# Altium project USRP2_Clone.PrjPcb (part 2 of 4)

## Sheet Ethernet.SchDoc: {Наименование}
size 420 x 297 mm; DocumentNumber: ПЛАС.ХХХХХХ.ХХХ ХХ; SheetNumber: 4; SheetTotal: 11; PageSetup: Record=PageOptions|CenterHorizontal=False|CenterVertical=False|PrintScale=0.95|XCorrection=0.00|YCorrection=0.00|PrintKind=1|BorderSize=5000000|LeftOffset=0|BottomOffset=0|Orientation=1|PaperLength=1000|PaperWidth=1000|Scale=100|PaperSource=15|PrintQuality=600|MediaType=1|DitherType=10|PaperKind=A4|PrintScaleMode=1; Rule: PcbType=ProtelPcb
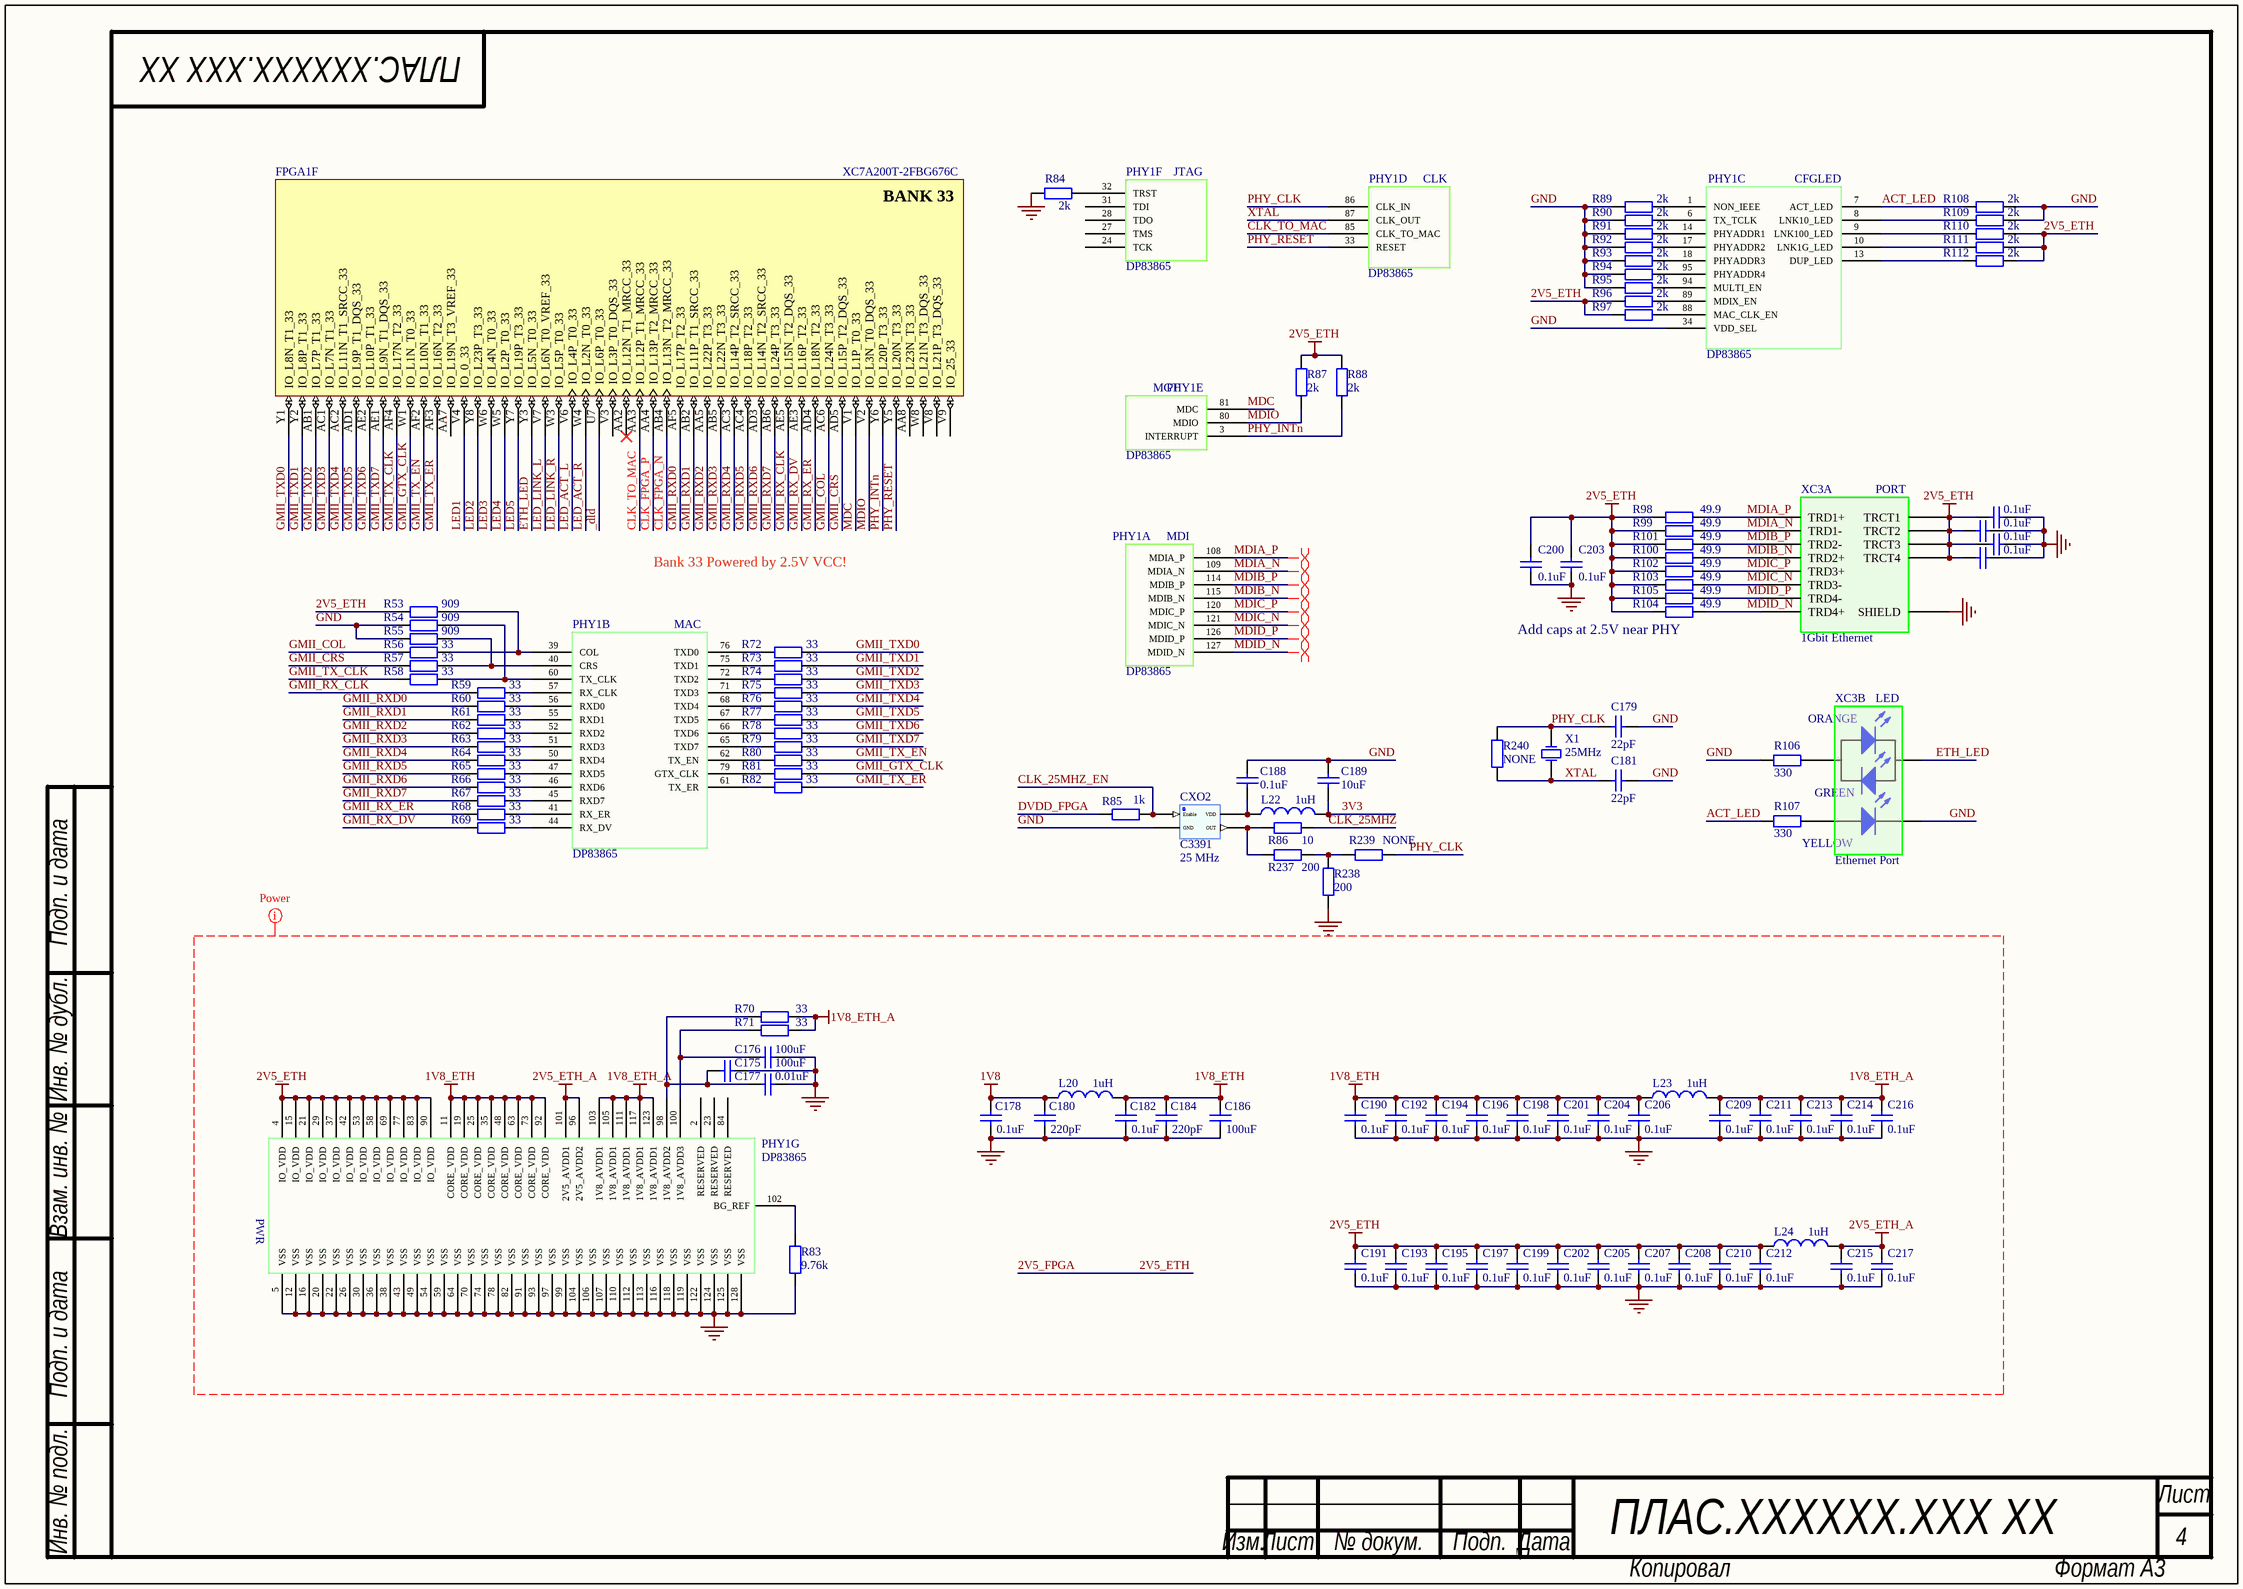
[diagram p3: Ethernet.SchDoc]

### Parts
C175  value 100uF  [C1210]  (hidden comment: Cap)
C176  value 100uF  [C1210]  (hidden comment: Cap)
C177  value 0.01uF  [C0603]  (hidden comment: Cap)
C178  value 0.1uF  [C0603]  (hidden comment: Cap)
C179  value 22pF  [С0402]  (hidden comment: Cap)
C180  value 220pF  [C0603]  (hidden comment: Cap)
C181  value 22pF  [С0402]  (hidden comment: Cap)
C182  value 0.1uF  [C0603]  (hidden comment: Cap)
C184  value 220pF  [C0603]  (hidden comment: Cap)
C186  value 100uF  [C1210]  (hidden comment: Cap)
C188  value 0.1uF  [C0603]  (hidden comment: Cap)
C189  value 10uF  [C0603]  (hidden comment: Cap)
C190  value 0.1uF  [C0603]  (hidden comment: Cap)
C191  value 0.1uF  [C0603]  (hidden comment: Cap)
C192  value 0.1uF  [C0603]  (hidden comment: Cap)
C193  value 0.1uF  [C0603]  (hidden comment: Cap)
C194  value 0.1uF  [C0603]  (hidden comment: Cap)
C195  value 0.1uF  [C0603]  (hidden comment: Cap)
C196  value 0.1uF  [C0603]  (hidden comment: Cap)
C197  value 0.1uF  [C0603]  (hidden comment: Cap)
C198  value 0.1uF  [C0603]  (hidden comment: Cap)
C199  value 0.1uF  [C0603]  (hidden comment: Cap)
C200  value 0.1uF  [С0402]  (hidden comment: Cap)
C201  value 0.1uF  [C0603]  (hidden comment: Cap)
C202  value 0.1uF  [C0603]  (hidden comment: Cap)
C203  value 0.1uF  [С0402]  (hidden comment: Cap)
C204  value 0.1uF  [C0603]  (hidden comment: Cap)
C205  value 0.1uF  [C0603]  (hidden comment: Cap)
C206  value 0.1uF  [C0603]  (hidden comment: Cap)
C207  value 0.1uF  [C0603]  (hidden comment: Cap)
C208  value 0.1uF  [C0603]  (hidden comment: Cap)
C209  value 0.1uF  [C0603]  (hidden comment: Cap)
C210  value 0.1uF  [C0603]  (hidden comment: Cap)
C211  value 0.1uF  [C0603]  (hidden comment: Cap)
C212  value 0.1uF  [C0603]  (hidden comment: Cap)
C213  value 0.1uF  [C0603]  (hidden comment: Cap)
C214  value 0.1uF  [C0603]  (hidden comment: Cap)
C215  value 0.1uF  [C0603]  (hidden comment: Cap)
C216  value 0.1uF  [C0603]  (hidden comment: Cap)
C217  value 0.1uF  [C0603]  (hidden comment: Cap)
C218  value 0.1uF  [С0402]  (hidden comment: Cap)
C219  value 0.1uF  [С0402]  (hidden comment: Cap)
C220  value 0.1uF  [С0402]  (hidden comment: Cap)
C221  value 0.1uF  [С0402]  (hidden comment: Cap)
CXO2  C3391  Frequency: 25 MHz  [CTS_CB3]
FPGA1  XC7A200T-2FBG676C  [FGG676]  (part F of 14)
L20  value 1uH  [L1210_Murata LQH]  (hidden comment: Inductor_LF)
L22  value 1uH  [L1206_Murata]  (hidden comment: Inductor_LF)
L23  value 1uH  [L1210_Murata LQH]  (hidden comment: Inductor_LF)
L24  value 1uH  [L1210_Murata LQH]  (hidden comment: Inductor_LF)
PHY1  DP83865  [LQFP-128]  (parts A,B,C,D,E,F,G of 7)
R53  value 909  [R0402]  (hidden comment: Res)
R54  value 909  [R0402]  (hidden comment: Res)
R55  value 909  [R0402]  (hidden comment: Res)
R56  value 33  [R0402]  (hidden comment: Res)
R57  value 33  [R0402]  (hidden comment: Res)
R58  value 33  [R0402]  (hidden comment: Res)
R59  value 33  [R0402]  (hidden comment: Res)
R60  value 33  [R0402]  (hidden comment: Res)
R61  value 33  [R0402]  (hidden comment: Res)
R62  value 33  [R0402]  (hidden comment: Res)
R63  value 33  [R0402]  (hidden comment: Res)
R64  value 33  [R0402]  (hidden comment: Res)
R65  value 33  [R0402]  (hidden comment: Res)
R66  value 33  [R0402]  (hidden comment: Res)
R67  value 33  [R0402]  (hidden comment: Res)
R68  value 33  [R0402]  (hidden comment: Res)
R69  value 33  [R0402]  (hidden comment: Res)
R70  value 33  [R0402]  (hidden comment: Res)
R71  value 33  [R0402]  (hidden comment: Res)
R72  value 33  [R0402]  (hidden comment: Res)
R73  value 33  [R0402]  (hidden comment: Res)
R74  value 33  [R0402]  (hidden comment: Res)
R75  value 33  [R0402]  (hidden comment: Res)
R76  value 33  [R0402]  (hidden comment: Res)
R77  value 33  [R0402]  (hidden comment: Res)
R78  value 33  [R0402]  (hidden comment: Res)
R79  value 33  [R0402]  (hidden comment: Res)
R80  value 33  [R0402]  (hidden comment: Res)
R81  value 33  [R0402]  (hidden comment: Res)
R82  value 33  [R0402]  (hidden comment: Res)
R83  value 9.76k  [R0402]  (hidden comment: Res)
R84  value 2k  [R0402]  (hidden comment: Res)
R85  value 1k  [R0402]  (hidden comment: Res)
R86  value 10  [R0402]  (hidden comment: Res)
R87  value 2k  [R0402]  (hidden comment: Res)
R88  value 2k  [R0402]  (hidden comment: Res)
R89  value 2k  [R0402]  (hidden comment: Res)
R90  value 2k  [R0402]  (hidden comment: Res)
R91  value 2k  [R0402]  (hidden comment: Res)
R92  value 2k  [R0402]  (hidden comment: Res)
R93  value 2k  [R0402]  (hidden comment: Res)
R94  value 2k  [R0402]  (hidden comment: Res)
R95  value 2k  [R0402]  (hidden comment: Res)
R96  value 2k  [R0402]  (hidden comment: Res)
R97  value 2k  [R0402]  (hidden comment: Res)
R98  value 49.9  [R0402]  (hidden comment: Res)
R99  value 49.9  [R0402]  (hidden comment: Res)
R100  value 49.9  [R0402]  (hidden comment: Res)
R101  value 49.9  [R0402]  (hidden comment: Res)
R102  value 49.9  [R0402]  (hidden comment: Res)
R103  value 49.9  [R0402]  (hidden comment: Res)
R104  value 49.9  [R0402]  (hidden comment: Res)
R105  value 49.9  [R0402]  (hidden comment: Res)
R106  value 330  [R0402]  (hidden comment: Res)
R107  value 330  [R0402]  (hidden comment: Res)
R108  value 2k  [R0402]  (hidden comment: Res)
R109  value 2k  [R0402]  (hidden comment: Res)
R110  value 2k  [R0402]  (hidden comment: Res)
R111  value 2k  [R0402]  (hidden comment: Res)
R112  value 2k  [R0402]  (hidden comment: Res)
R237  value 200  [R0402]  (hidden comment: Res)
R238  value 200  [R0402]  (hidden comment: Res)
R239  value NONE  [R0402]  (hidden comment: Res)
R240  value NONE  [R0402]  (hidden comment: Res)
X1  25MHz  [XTAL]
XC3  1Gbit Ethernet  [0826-1X1T-23-F]  (parts A,B of 2)

### Nets
1V8: C178.1 C180.1 L20.2
1V8_ETH: C182.1 C184.1 C186.1 C190.2 C192.1 C194.1 C196.2 C198.1 C201.1 C204.1 C206.1 L20.1 L23.1 PHY1.11(CORE_VDD) PHY1.19(CORE_VDD) PHY1.25(CORE_VDD) PHY1.35(CORE_VDD) PHY1.48(CORE_VDD) PHY1.63(CORE_VDD) PHY1.73(CORE_VDD) PHY1.92(CORE_VDD)
1V8_ETH_A: C209.1 C211.1 C213.1 C214.1 C216.1 L23.2 PHY1.103(1V8_AVDD1) PHY1.105(1V8_AVDD1) PHY1.111(1V8_AVDD1) PHY1.117(1V8_AVDD1) PHY1.123(1V8_AVDD1) R70.1 R71.1
2V5_ETH: C191.1 C193.1 C195.1 C197.1 C199.2 C200.1 C202.2 C203.1 C205.1 C207.1 C208.1 C210.1 C212.1 C218.1 C219.1 C220.1 C221.1 L24.1 PHY1.4(IO_VDD) PHY1.15(IO_VDD) PHY1.21(IO_VDD) PHY1.29(IO_VDD) PHY1.37(IO_VDD) PHY1.42(IO_VDD) PHY1.53(IO_VDD) PHY1.58(IO_VDD) PHY1.69(IO_VDD) PHY1.77(IO_VDD) PHY1.83(IO_VDD) PHY1.90(IO_VDD) R53.1 R87.1 R88.1 R96.1 R97.1 R98.1 R99.1 R100.1 R101.1 R102.1 R103.1 R104.1 R105.1 R110.2 R111.2 R112.2 XC3.1(TRCT3) XC3.6(TRCT2) XC3.7(TRCT4) XC3.12(TRCT1)  [also labelled 2V5_FPGA]
2V5_ETH_A: C215.1 C217.1 L24.2 PHY1.96(2V5_AVDD2) PHY1.101(2V5_AVDD1)
3V3: C189.2 L22.1
DVDD_FPGA: R85.2
GND: C175.1 C176.1 C177.1 C178.2 C179.2 C180.2 C181.2 C182.2 C184.2 C186.2 C188.2 C189.1 C190.1 C191.2 C192.2 C193.2 C194.2 C195.2 C196.1 C197.2 C198.2 C199.1 C200.2 C201.2 C202.1 C203.2 C204.2 C205.2 C206.2 C207.2 C208.2 C209.2 C210.2 C211.2 C212.2 C213.2 C214.2 C215.2 C216.2 C217.2 C218.2 C219.2 C220.2 C221.2 CXO2.2(GND) PHY1.5(VSS) PHY1.12(VSS) PHY1.16(VSS) PHY1.20(VSS) PHY1.22(VSS) PHY1.26(VSS) PHY1.30(VSS) PHY1.34(VDD_SEL) PHY1.36(VSS) PHY1.38(VSS) PHY1.43(VSS) PHY1.49(VSS) PHY1.54(VSS) PHY1.59(VSS) PHY1.64(VSS) PHY1.70(VSS) PHY1.74(VSS) PHY1.78(VSS) PHY1.82(VSS) PHY1.91(VSS) PHY1.93(VSS) PHY1.97(VSS) PHY1.99(VSS) PHY1.104(VSS) PHY1.106(VSS) PHY1.107(VSS) PHY1.110(VSS) PHY1.112(VSS) PHY1.113(VSS) PHY1.116(VSS) PHY1.118(VSS) PHY1.119(VSS) PHY1.122(VSS) PHY1.124(VSS) PHY1.125(VSS) PHY1.128(VSS) R54.1 R55.2 R83.2 R84.2 R89.2 R90.2 R91.1 R92.2 R93.1 R94.1 R95.1 R106.2 R108.1 R109.1 R238.2 XC3.0(SHIELD) XC3.13(LED1)
_dld: FPGA1.U7(IO_L6P_T0_33)
ACT_LED: PHY1.7(ACT_LED) R107.1 R108.2
CLK_25MHZ: R86.1
CLK_25MHZ_EN: CXO2.1(Enable) R85.1
CLK_FPGA_N: FPGA1.AB4(IO_L13N_T2_MRCC_33)
CLK_FPGA_P: FPGA1.AA4(IO_L13P_T2_MRCC_33)
CLK_TO_MAC: FPGA1.AA3(IO_L12P_T1_MRCC_33) PHY1.85(CLK_TO_MAC)
ETH_LED: FPGA1.Y3(IO_L5N_T0_33) XC3.16(LED2)
GMII_COL: FPGA1.AC6(IO_L24N_T3_33) R56.1
GMII_CRS: FPGA1.AD5(IO_L15P_T2_DQS_33) R57.1
GMII_GTX_CLK: FPGA1.W1(IO_L1N_T0_33) R81.2
GMII_RX_CLK: FPGA1.AE5(IO_L15N_T2_DQS_33) R59.2
GMII_RX_DV: FPGA1.AE3(IO_L16P_T2_33) R69.2
GMII_RX_ER: FPGA1.AD4(IO_L18N_T2_33) R68.2
GMII_RXD0: FPGA1.AF5(IO_L17P_T2_33) R60.2
GMII_RXD1: FPGA1.AB2(IO_L11P_T1_SRCC_33) R61.2
GMII_RXD2: FPGA1.AA5(IO_L22P_T3_33) R62.2
GMII_RXD3: FPGA1.AB5(IO_L22N_T3_33) R63.2
GMII_RXD4: FPGA1.AC3(IO_L14P_T2_SRCC_33) R64.2
GMII_RXD5: FPGA1.AC4(IO_L18P_T2_33) R65.2
GMII_RXD6: FPGA1.AD3(IO_L14N_T2_SRCC_33) R66.2
GMII_RXD7: FPGA1.AB6(IO_L24P_T3_33) R67.2
GMII_TX_CLK: FPGA1.AF4(IO_L17N_T2_33) R58.1
GMII_TX_EN: FPGA1.AF2(IO_L10N_T1_33) R80.2
GMII_TX_ER: FPGA1.AF3(IO_L16N_T2_33) R82.2
GMII_TXD0: FPGA1.Y1(IO_L8N_T1_33) R72.2
GMII_TXD1: FPGA1.Y2(IO_L8P_T1_33) R73.2
GMII_TXD2: FPGA1.AB1(IO_L7P_T1_33) R74.2
GMII_TXD3: FPGA1.AC1(IO_L7N_T1_33) R75.2
GMII_TXD4: FPGA1.AC2(IO_L11N_T1_SRCC_33) R76.2
GMII_TXD5: FPGA1.AD1(IO_L9P_T1_DQS_33) R77.2
GMII_TXD6: FPGA1.AE2(IO_L10P_T1_33) R78.2
GMII_TXD7: FPGA1.AE1(IO_L9N_T1_DQS_33) R79.2
LED1: FPGA1.V4(IO_0_33)
LED2: FPGA1.Y8(IO_L23P_T3_33)
LED3: FPGA1.W6(IO_L4N_T0_33)
LED4: FPGA1.W5(IO_L2P_T0_33)
LED5: FPGA1.Y7(IO_L19P_T3_33)
LED_ACT_L: FPGA1.V6(IO_L4P_T0_33)
LED_ACT_R: FPGA1.W4(IO_L2N_T0_33)
LED_LINK_L: FPGA1.V7(IO_L6N_T0_VREF_33)
LED_LINK_R: FPGA1.W3(IO_L5P_T0_33)
MDC: FPGA1.V1(IO_L1P_T0_33) PHY1.81(MDC)
MDIA_N: PHY1.109(MDIA_N) R99.2 XC3.10(TRD1-)
MDIA_P: PHY1.108(MDIA_P) R98.2 XC3.11(TRD1+)
MDIB_N: PHY1.115(MDIB_N) R100.2 XC3.4(TRD2+)
MDIB_P: PHY1.114(MDIB_P) R101.2 XC3.5(TRD2-)
MDIC_N: PHY1.121(MDIC_N) R103.2 XC3.2(TRD3-)
MDIC_P: PHY1.120(MDIC_P) R102.2 XC3.3(TRD3+)
MDID_N: PHY1.127(MDID_N) R104.2 XC3.8(TRD4+)
MDID_P: PHY1.126(MDID_P) R105.2 XC3.9(TRD4-)
MDIO: FPGA1.V2(IO_L3N_T0_DQS_33) PHY1.80(MDIO) R87.2
PHY_CLK: C179.1 PHY1.86(CLK_IN) R239.1 R240.1 X1.3(OSC2)
PHY_INTn: FPGA1.Y6(IO_L20P_T3_33) PHY1.3(INTERRUPT) R88.2
PHY_RESET: FPGA1.Y5(IO_L20N_T3_33) PHY1.33(RESET)
XTAL: C181.1 PHY1.87(CLK_OUT) R240.2 X1.1(OSC1)
NetC175_2: C175.2 C177.2 PHY1.98(1V8_AVDD2) R70.2
NetC176_2: C176.2 PHY1.100(1V8_AVDD3) R71.2
NetC188_1: C188.1 CXO2.4(VDD) L22.2
NetCXO2_3: CXO2.3(OUT) R86.2 R237.1
NetPHY1_1: PHY1.1(NON_IEEE) R89.1
NetPHY1_6: PHY1.6(TX_TCLK) R90.1
NetPHY1_8: PHY1.8(LNK10_LED) R109.2
NetPHY1_9: PHY1.9(LNK100_LED) R110.1
NetPHY1_10: PHY1.10(LNK1G_LED) R111.1
NetPHY1_13: PHY1.13(DUP_LED) R112.1
NetPHY1_14: PHY1.14(PHYADDR1) R91.2
NetPHY1_17: PHY1.17(PHYADDR2) R92.1
NetPHY1_18: PHY1.18(PHYADDR3) R93.2
NetPHY1_32: PHY1.32(TRST) R84.1
NetPHY1_39: PHY1.39(COL) R53.2 R56.2
NetPHY1_40: PHY1.40(CRS) R55.1 R57.2
NetPHY1_41: PHY1.41(RX_ER) R68.1
NetPHY1_44: PHY1.44(RX_DV) R69.1
NetPHY1_45: PHY1.45(RXD7) R67.1
NetPHY1_46: PHY1.46(RXD6) R66.1
NetPHY1_47: PHY1.47(RXD5) R65.1
NetPHY1_50: PHY1.50(RXD4) R64.1
NetPHY1_51: PHY1.51(RXD3) R63.1
NetPHY1_52: PHY1.52(RXD2) R62.1
NetPHY1_55: PHY1.55(RXD1) R61.1
NetPHY1_56: PHY1.56(RXD0) R60.1
NetPHY1_57: PHY1.57(RX_CLK) R59.1
NetPHY1_60: PHY1.60(TX_CLK) R54.2 R58.2
NetPHY1_61: PHY1.61(TX_ER) R82.1
NetPHY1_62: PHY1.62(TX_EN) R80.1
NetPHY1_65: PHY1.65(TXD7) R79.1
NetPHY1_66: PHY1.66(TXD6) R78.1
NetPHY1_67: PHY1.67(TXD5) R77.1
NetPHY1_68: PHY1.68(TXD4) R76.1
NetPHY1_71: PHY1.71(TXD3) R75.1
NetPHY1_72: PHY1.72(TXD2) R74.1
NetPHY1_75: PHY1.75(TXD1) R73.1
NetPHY1_76: PHY1.76(TXD0) R72.1
NetPHY1_79: PHY1.79(GTX_CLK) R81.1
NetPHY1_88: PHY1.88(MAC_CLK_EN) R97.2
NetPHY1_89: PHY1.89(MDIX_EN) R96.2
NetPHY1_94: PHY1.94(MULTI_EN) R95.2
NetPHY1_95: PHY1.95(PHYADDR4) R94.2
NetPHY1_102: PHY1.102(BG_REF) R83.1
NetR106_1: R106.1 XC3.15
NetR107_2: R107.2 XC3.14
NetR237_2: R237.2 R238.1 R239.2

Not connected (* = marked no-connect by the designer): FPGA1 AA2(IO_L12N_T1_MRCC_33)* AA7(IO_L19N_T3_VREF_33) AA8(IO_L23N_T3_33) V3(IO_L3P_T0_DQS_33) V8(IO_L21P_T3_DQS_33) V9(IO_25_33) W8(IO_L21N_T3_DQS_33); PHY1 2(RESERVED) 23(RESERVED) 24(TCK) 27(TMS) 28(TDO) 31(TDI) 84(RESERVED)

### Layout directives
differential pair: MDIA_N, MDIA_P, MDIB_N, MDIB_P, MDIC_N, MDIC_P, MDID_N, MDID_P
net class Power: 1V8, 1V8_ETH, 1V8_ETH_A, 2V5_ETH, 2V5_ETH_A, 2V5_FPGA, GND

### Notes on the sheet
- Bank 33 Powered by 2.5V VCC!
- (near R104) Add caps at 2.5V near PHY
- Подп. и дата
- Инв. № дубл.
- Взам. инв. №
- Инв. № подл.
- Лист
- Изм.
- № докум.
- Подп.
- Дата
- Копировал
- Формат А3
- (in symbol 0826-1X1T-23-F, part A) PORT
- (in symbol 0826-1X1T-23-F, part B) LED; ORANGE; GREEN; YELLOW
- (in symbol DP83865, part A) MDI
- (in symbol DP83865, part B) MAC
- (in symbol DP83865, part C) CFGLED
- (in symbol DP83865, part D) CLK
- (in symbol DP83865, part E) MGT
- (in symbol DP83865, part F) JTAG
- (in symbol DP83865, part G) PWR
- (in symbol XC7A200T-2FBG676C, part F) BANK 33

### Library data of the parts
C175 C176 C186 = Cap uF: as C6 on sheet Power_Supply; Package: C1210; PackageDescription: SMD Chip Capacitor
C177 = Cer Cap: Cer Cap Small; Manufacturer: Murata; Material: x5r; Voltage: 50V; Tolerance: 10%; Type: Ceramic; PackageReference: SMD Chip Capacitor; Package: 0603
C178 C180 C182 C184 C188 C190-C199 C201 C202 C204-C217 = Cer Cap: as C3 on sheet Power_Supply; PackageReference: SMD Chip Capacitor; Package: 0603
C179 C181 = Cer Cap: Cer Cap Small; Manufacturer: Murata; Material: NP0; Voltage: 50V; Tolerance: 10%; Type: Ceramic; PackageReference: SMD Chip Capacitor; Package: 0402
C189 = Cer Cap: Cer Cap Small; Manufacturer: Murata; Material: x7r; Voltage: 6.3V; Tolerance: 10%; Type: Ceramic; PackageReference: SMD Chip Capacitor; Package: 0603
C200 C203 = Cer Cap: as C9 on sheet Power_Supply; PackageReference: SMD Chip Capacitor; Package: 0402
C218-C221 = Cer Cap: as C1 on sheet Power_Supply; PackageReference: SMD Chip Capacitor; Package: 0402
CXO2 = 5x7 CXO: Crystal Oscillator; Manufacturer: Crystek; Name: C3391-25.000; Voltage: 3.3V ±0.3V; Output Current: ±24mA Max; Input Current: 15mA Typical; Stability: ± 25ppm; Package: 5×7 mm SMD; Temperature Range: 0°C to +70°C; Type: 3.3V, HCMOS
FPGA1 = XC7A200T-2FBG676C: as FPGA1 on sheet FPGA_Power; DatasheetVersion: v1.12; PackageVersion: Rev 1.8; PackageReference: FBG676; PackageDescription: Flip-Chip Lidless BGA, Body 27 x 27 mm, 1.0 mm Pitch; Supplier 1: Digi-Key; Supplier Part Number 1: 122-1865-ND; CLBs (Max Distributed RAM Kb): 2888; Generic Part Number: XC7A200T; RoHS: Pb-Free; NexusDeviceID: XC7A200T-2FBG676C; Mounting Technology: Surface Mount; Code_JEDEC: MS-034; PartNumber: XC7A200T-2FBG676C; ComponentLink1Description: Manufacturer URL; ComponentLink1URL: http://www.xilinx.com/; ComponentLink2Description: Datasheet; ComponentLink2URL: http://www.xilinx.com/support/documentation/data_sheets/ds180_7Series_Overview.pdf; ComponentLink3Description: Package Specification; ComponentLink3URL: http://www.xilinx.com/support/documentation/user_guides/ug475_7Series_Pkg_Pinout.pdf; ComponentLink4Description: DC and Switching Characteristics; ComponentLink4URL: http://www.xilinx.com/support/documentation/data_sheets/ds181_Artix_7_Data_Sheet.pdf; ComponentLink5Description: Package File; ComponentLink5URL: http://www.xilinx.com/support/packagefiles/a7packages/xc7a200tfbg676pkg.txt; ComponentLink6Description: Packaging and Pinout; ComponentLink6URL: http://www.xilinx.com/support/documentation/user_guides/ug475_7Series_Pkg_Pinout.pdf
L20 L23 L24 = Inductor_LF: Inductor_Power_Lines; Manufacturer: Murata; Name: LQH32PN1R0NNC; Tolerance: 5%; Current: 2500mA; Frequency: 100MHz; Package: 1210; PackageDescription: Chip Inductor; Temperature Range: -25…85; Series: LQH
L22 = Inductor_LF: Inductor_Power_Lines; Manufacturer: Murata; Name: LQM31PN1R0M00; Tolerance: 5%; Current: 1200mA; Frequency: 60MHz; Package: 1206; PackageDescription: Chip Inductor; Temperature Range: -25…85; Series: LQM
PHY1 = DP83865: 10/100/1000 Ethernet Physical Layer; Name: DP83865DVH; Type: 10/100/1000 Ethernet Physical Layer; Package: LQFP-128
R53-R112 R237-R240 = Res: as R2 on sheet Power_Supply; Package: SMD; Temperature Range: -55…155
X1 = XTAL: Manufacturer: GEYER ELECTRONIC; Name: KX-13T; Frequancy: 25.000MHz; Ttolerance: ± 30 ppm
XC3 = 0826-1X1T-23-F: Gigabit Single Port; Name: 0826-1X1T-23-F; Type: Gigabit Ethernet Single Port with LEDs

## Sheet JTAG.SchDoc: {Наименование}
size 420 x 297 mm; DocumentNumber: ПЛАС.ХХХХХХ.ХХХ ХХ; SheetNumber: 5; SheetTotal: 11; PageSetup: Record=PageOptions|CenterHorizontal=False|CenterVertical=False|PrintScale=0.95|XCorrection=0.00|YCorrection=0.00|PrintKind=1|BorderSize=5000000|LeftOffset=0|BottomOffset=0|Orientation=1|PaperLength=1000|PaperWidth=1000|Scale=100|PaperSource=15|PrintQuality=600|MediaType=1|DitherType=10|PaperKind=A4|PrintScaleMode=1; Rule: PcbType=ProtelPcb
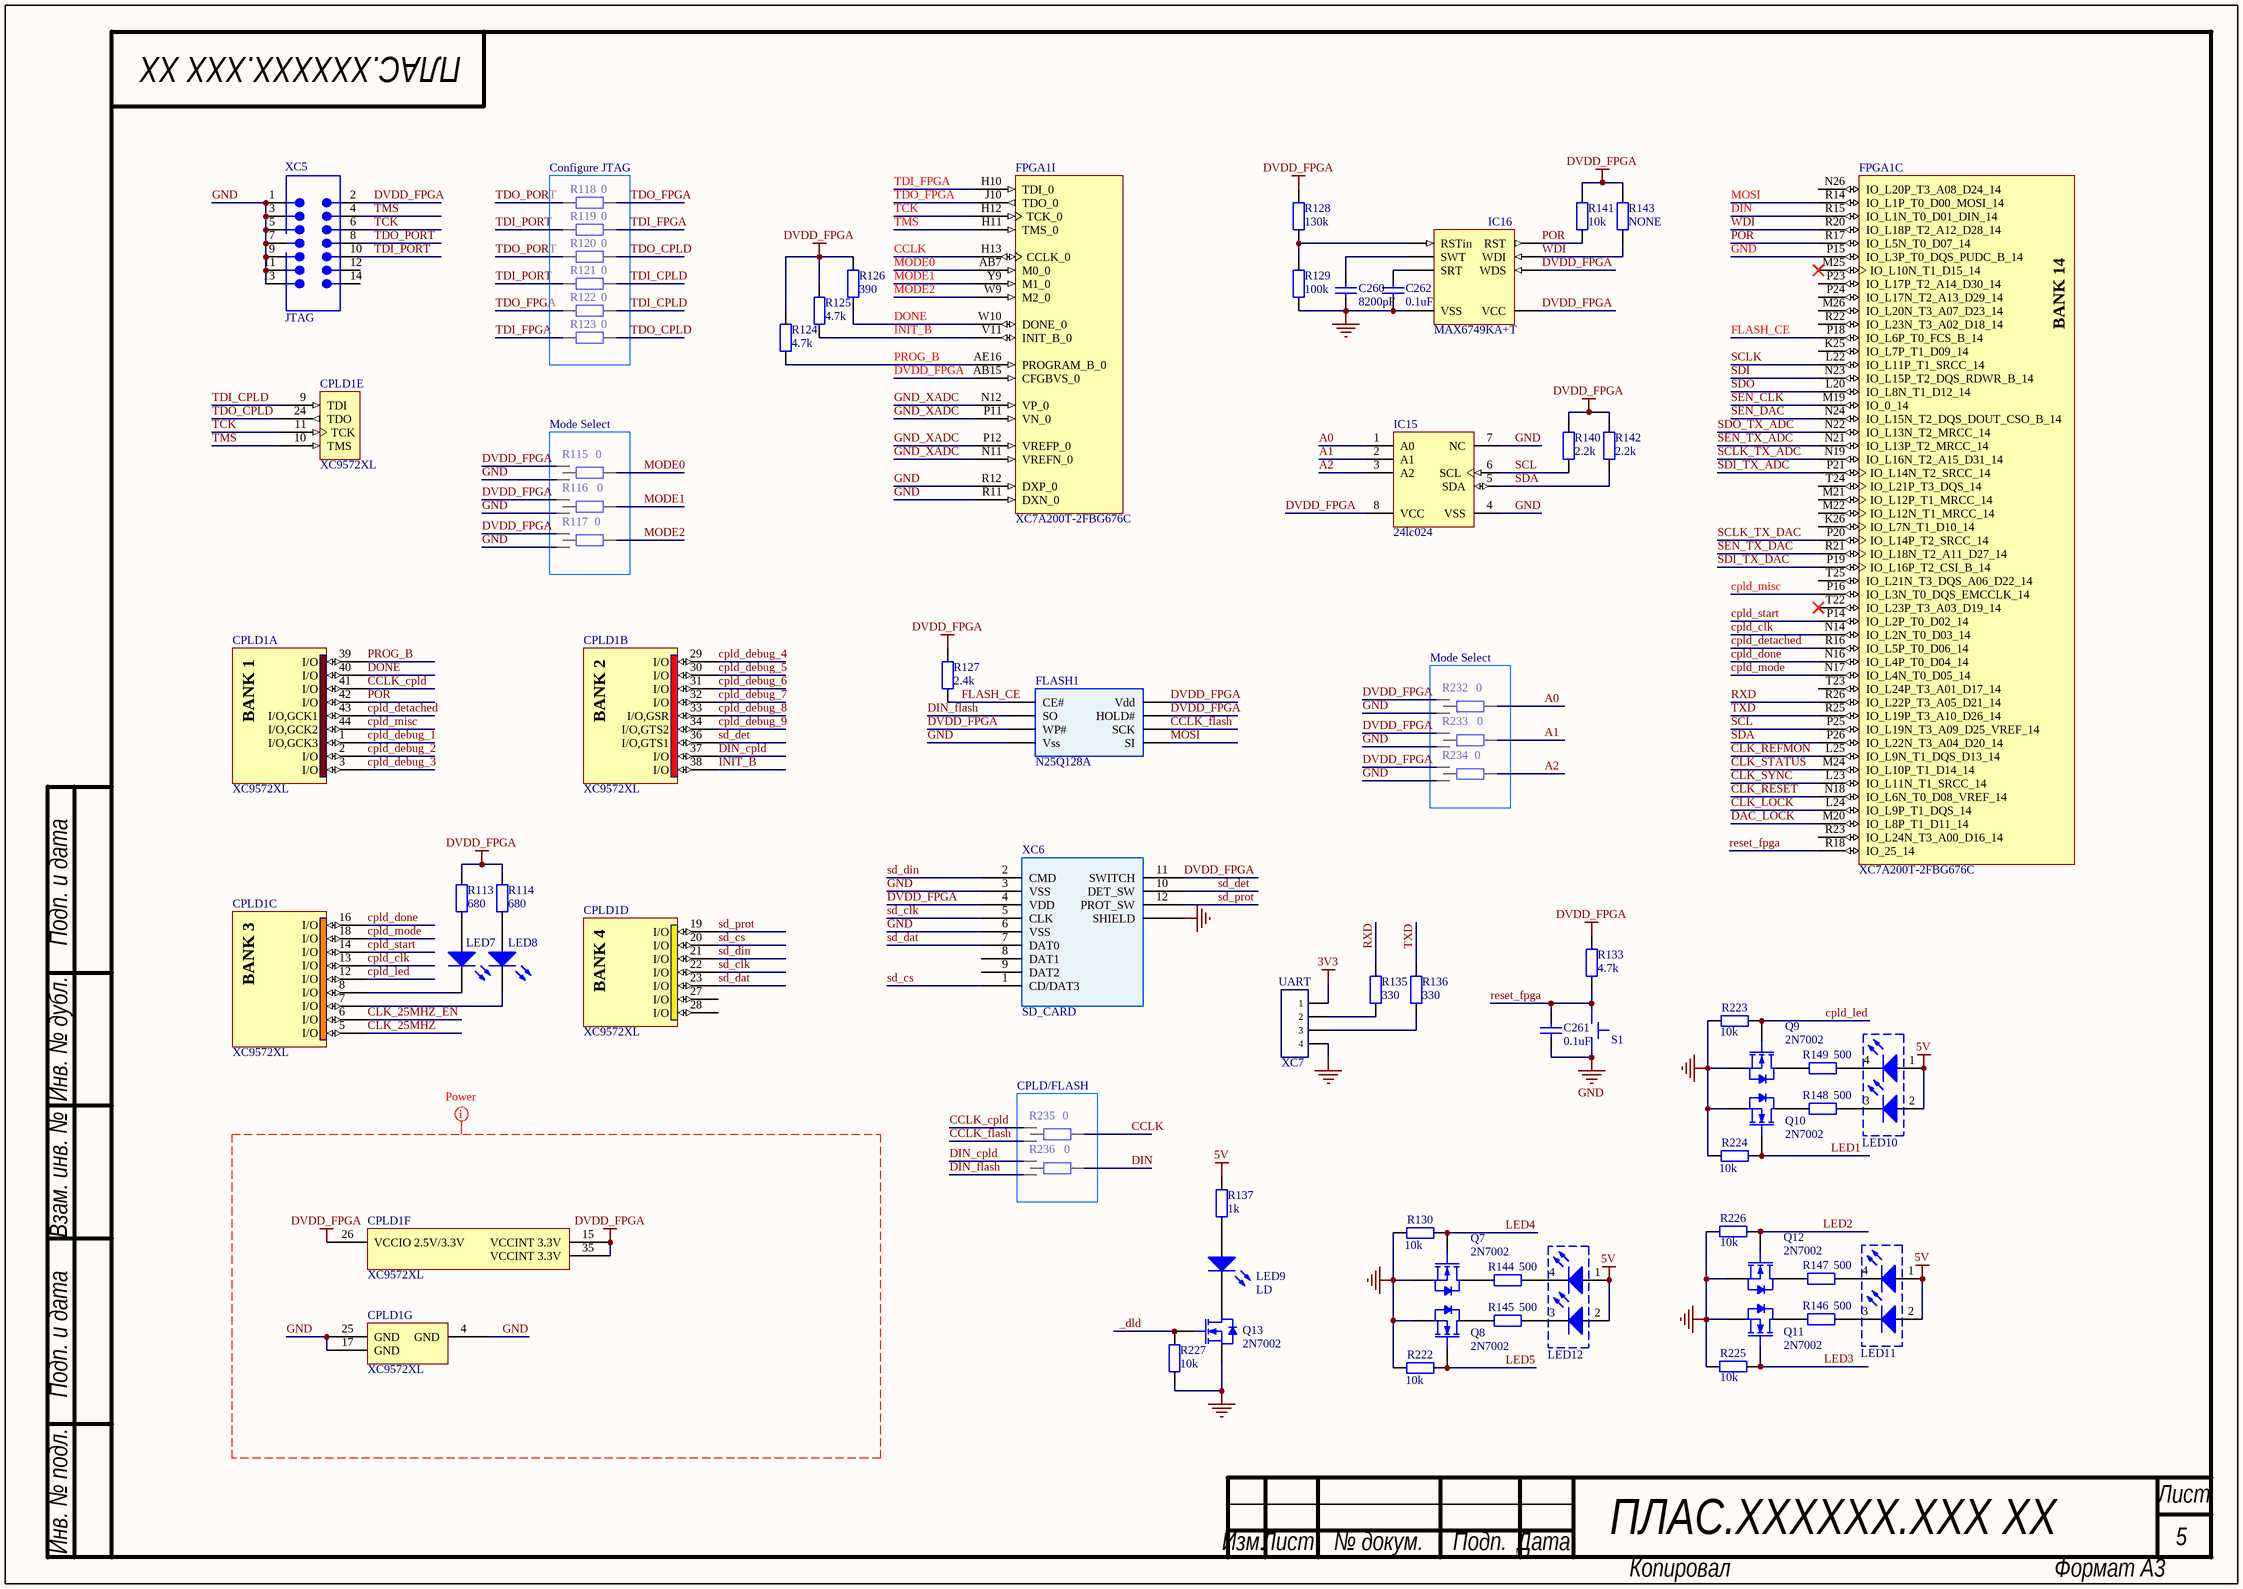
[diagram p4: JTAG.SchDoc]

### Parts
C260  value 8200pF  [C0603]  (hidden comment: Cap)
C261  value 0.1uF  [C0603]  (hidden comment: Cap)
C262  value 0.1uF  [C0603]  (hidden comment: Cap)
CPLD1  XC9572XL  [VQFP44]  (parts A,B,C,D,E,F,G of 7)
FLASH1  N25Q128A  [SOIC8-W]
FPGA1  XC7A200T-2FBG676C  [FGG676]  (parts C,I of 14)
IC15  24lc024  [SOIC_SN8]
IC16  MAX6749KA+T  [SOT-23-8]
LED7  LED  [LED_0402_Blue]  (value not drawn)
LED8  LED  [LED_0402_Blue]  (value not drawn)
LED9  LD  [LED_0402_Blue]
LED10  Green  [LED_PACK]  (value not drawn)
LED11  Green  [LED_PACK]  (value not drawn)
LED12  Green  [LED_PACK]  (value not drawn)
Q7  2N7002  [SOT-23]
Q8  2N7002  [SOT-23]
Q9  2N7002  [SOT-23]
Q10  2N7002  [SOT-23]
Q11  2N7002  [SOT-23]
Q12  2N7002  [SOT-23]
Q13  2N7002  [SOT-23]
R113  value 680  [R0402]  (hidden comment: Res)
R114  value 680  [R0402]  (hidden comment: Res)
R115  value 0  [R0402_Switch]  (hidden comment: Res_Switch)
R116  value 0  [R0402_Switch]  (hidden comment: Res_Switch)
R117  value 0  [R0402_Switch]  (hidden comment: Res_Switch)
R118  value 0  [R0402]  (hidden comment: Res)
R119  value 0  [R0402]  (hidden comment: Res)
R120  value 0  [R0402]  (hidden comment: Res)
R121  value 0  [R0402]  (hidden comment: Res)
R122  value 0  [R0402]  (hidden comment: Res)
R123  value 0  [R0402]  (hidden comment: Res)
R124  value 4.7k  [R0402]  (hidden comment: Res)
R125  value 4.7k  [R0402]  (hidden comment: Res)
R126  value 390  [R0402]  (hidden comment: Res)
R127  value 2.4k  [R0402]  (hidden comment: Res)
R128  value 130k  [R0402]  (hidden comment: Res)
R129  value 100k  [R0402]  (hidden comment: Res)
R130  value 10k  [R0402]  (hidden comment: Res)
R133  value 4.7k  [R0402]  (hidden comment: Res)
R135  value 330  [R0402]  (hidden comment: Res)
R136  value 330  [R0402]  (hidden comment: Res)
R137  value 1k  [R0402]  (hidden comment: Res)
R140  value 2.2k  [R0402]  (hidden comment: Res)
R141  value 10k  [R0402]  (hidden comment: Res)
R142  value 2.2k  [R0402]  (hidden comment: Res)
R143  value NONE  [R0402]  (hidden comment: Res)
R144  value 500  [R0402]  (hidden comment: Res)
R145  value 500  [R0402]  (hidden comment: Res)
R146  value 500  [R0402]  (hidden comment: Res)
R147  value 500  [R0402]  (hidden comment: Res)
R148  value 500  [R0402]  (hidden comment: Res)
R149  value 500  [R0402]  (hidden comment: Res)
R222  value 10k  [R0402]  (hidden comment: Res)
R223  value 10k  [R0402]  (hidden comment: Res)
R224  value 10k  [R0402]  (hidden comment: Res)
R225  value 10k  [R0402]  (hidden comment: Res)
R226  value 10k  [R0402]  (hidden comment: Res)
R227  value 10k  [R0402]  (hidden comment: Res)
R232  value 0  [R0402_Switch]  (hidden comment: Res_Switch)
R233  value 0  [R0402_Switch]  (hidden comment: Res_Switch)
R234  value 0  [R0402_Switch]  (hidden comment: Res_Switch)
R235  value 0  [R0402_Switch]  (hidden comment: Res_Switch)
R236  value 0  [R0402_Switch]  (hidden comment: Res_Switch)
S1  RST_FPGA  [B3FS-1000]  (value not drawn)
XC5  JTAG  [JTAG Mail]
XC6  SD_CARD  [SD_Card]
XC7  UART  [Right Angle Male Header]

### Blocks framed on the sheet
Configure JTAG: R118-R123
Mode Select: R115-R117
Mode Select: R232-R234
CPLD/FLASH: R235 R236

### Nets
3V3: XC7.1
5V: LED10.1(A) LED10.2(A) LED11.1(A) LED11.2(A) LED12.1(A) LED12.2(A) R137.2
DVDD_FPGA: CPLD1.15(VCCINT_3.3V) CPLD1.26(VCCIO_2.5V/3.3V) CPLD1.35(VCCINT_3.3V) FLASH1.3(WP#) FLASH1.7(HOLD#) FLASH1.8(Vdd) FPGA1.AB15(CFGBVS_0) IC15.8(VCC) IC16.5(WDS) IC16.8(VCC) R113.2 R114.2 R115.1 R116.1 R117.1 R124.1 R125.2 R126.1 R127.1 R128.2 R133.2 R140.2 R141.2 R142.2 R143.2 R232.1 R233.1 R234.1 XC5.2(VREF) XC6.4(VDD) XC6.11(SWITCH)
GND: C260.1 C261.2 C262.1 CPLD1.4(GND) CPLD1.17(GND) CPLD1.25(GND) FLASH1.4(Vss) FPGA1.P15(IO_L3P_T0_DQS_PUDC_B_14) FPGA1.R11(DXN_0) FPGA1.R12(DXP_0) IC15.4(VSS) IC15.7(NC) IC16.4(VSS) Q7.2(S) Q8.2(S) Q9.2(S) Q10.2(S) Q11.2(S) Q12.2(S) Q13.2(S) R115.3 R116.3 R117.3 R129.1 R130.2 R222.2 R223.2 R224.2 R225.2 R226.2 R227.1 R232.3 R233.3 R234.3 S1.2 XC5.1(GND) XC5.3(GND) XC5.5(GND) XC5.7(GND) XC5.9(GND) XC5.11(GND) XC5.13(GND) XC6.0(SHIELD) XC6.3(VSS) XC6.6(VSS) XC7.4
GND_XADC: FPGA1.N11(VREFN_0) FPGA1.N12(VP_0) FPGA1.P11(VN_0) FPGA1.P12(VREFP_0)
_dld: Q13.1(G) R227.2
A0: IC15.1(A0) R232.2
A1: IC15.2(A1) R233.2
A2: IC15.3(A2) R234.2
CCLK: FPGA1.H13(CCLK_0) R235.2
CCLK_cpld: CPLD1.41(I/O) R235.1
CCLK_flash: FLASH1.6(SCK) R235.3
CLK_25MHZ: CPLD1.5(I/O)
CLK_25MHZ_EN: CPLD1.6(I/O)
CLK_LOCK: FPGA1.L24(IO_L9P_T1_DQS_14)
CLK_REFMON: FPGA1.L25(IO_L9N_T1_DQS_D13_14)
CLK_RESET: FPGA1.N18(IO_L6N_T0_D08_VREF_14)
CLK_STATUS: FPGA1.M24(IO_L10P_T1_D14_14)
CLK_SYNC: FPGA1.L23(IO_L11N_T1_SRCC_14)
cpld_clk: CPLD1.13(I/O) FPGA1.N14(IO_L2N_T0_D03_14)
cpld_debug_1: CPLD1.1(I/O,GCK3)
cpld_debug_2: CPLD1.2(I/O)
cpld_debug_3: CPLD1.3(I/O)
cpld_debug_4: CPLD1.29(I/O)
cpld_debug_5: CPLD1.30(I/O)
cpld_debug_6: CPLD1.31(I/O)
cpld_debug_7: CPLD1.32(I/O)
cpld_debug_8: CPLD1.33(I/O,GSR)
cpld_debug_9: CPLD1.34(I/O,GTS2)
cpld_detached: CPLD1.43(I/O,GCK1) FPGA1.R16(IO_L5P_T0_D06_14)
cpld_done: CPLD1.16(I/O) FPGA1.N16(IO_L4P_T0_D04_14)
cpld_led: CPLD1.12(I/O) Q9.1(G) R223.1
cpld_misc: CPLD1.44(I/O,GCK2) FPGA1.P16(IO_L3N_T0_DQS_EMCCLK_14)
cpld_mode: CPLD1.18(I/O) FPGA1.N17(IO_L4N_T0_D05_14)
cpld_start: CPLD1.14(I/O) FPGA1.P14(IO_L2P_T0_D02_14)
DAC_LOCK: FPGA1.M20(IO_L8P_T1_D11_14)
DIN: FPGA1.R15(IO_L1N_T0_D01_DIN_14) R236.2
DIN_cpld: CPLD1.37(I/O) R236.1
DIN_flash: FLASH1.2(SO) R236.3
DONE: CPLD1.40(I/O) FPGA1.W10(DONE_0) R126.2
FLASH_CE: FLASH1.1(CE#) FPGA1.P18(IO_L6P_T0_FCS_B_14) R127.2
INIT_B: CPLD1.38(I/O) FPGA1.V11(INIT_B_0) R125.1
LED1: Q10.1(G) R224.1
LED2: Q12.1(G) R226.1
LED3: Q11.1(G) R225.1
LED4: Q7.1(G) R130.1
LED5: Q8.1(G) R222.1
MODE0: FPGA1.AB7(M0_0) R115.2
MODE1: FPGA1.Y9(M1_0) R116.2
MODE2: FPGA1.W9(M2_0) R117.2
MOSI: FLASH1.5(SI) FPGA1.R14(IO_L1P_T0_D00_MOSI_14)
POR: CPLD1.42(I/O) FPGA1.R17(IO_L5N_T0_D07_14) IC16.7(RST) R141.1
PROG_B: CPLD1.39(I/O) FPGA1.AE16(PROGRAM_B_0) R124.2
reset_fpga: C261.1 FPGA1.R18(IO_25_14) R133.1 S1.1
RXD: FPGA1.R26(IO_L22P_T3_A05_D21_14) R135.1
SCL: FPGA1.P25(IO_L19N_T3_A09_D25_VREF_14) IC15.6(SCL) R140.1
SCLK: FPGA1.L22(IO_L11P_T1_SRCC_14)
SCLK_TX_ADC: FPGA1.N19(IO_L16N_T2_A15_D31_14)
SCLK_TX_DAC: FPGA1.P20(IO_L14P_T2_SRCC_14)
sd_clk: CPLD1.22(I/O) XC6.5(CLK)
sd_cs: CPLD1.20(I/O) XC6.1(CD/DAT3)
sd_dat: CPLD1.23(I/O) XC6.7(DAT0)
sd_det: CPLD1.36(I/O,GTS1) XC6.10(DET_SW)
sd_din: CPLD1.21(I/O) XC6.2(CMD)
sd_prot: CPLD1.19(I/O) XC6.12(PROT_SW)
SDA: FPGA1.P26(IO_L22N_T3_A04_D20_14) IC15.5(SDA) R142.1
SDI: FPGA1.N23(IO_L15P_T2_DQS_RDWR_B_14)
SDI_TX_ADC: FPGA1.P21(IO_L14N_T2_SRCC_14)
SDI_TX_DAC: FPGA1.P19(IO_L16P_T2_CSI_B_14)
SDO: FPGA1.L20(IO_L8N_T1_D12_14)
SDO_TX_ADC: FPGA1.N22(IO_L13N_T2_MRCC_14)
SEN_CLK: FPGA1.M19(IO_0_14)
SEN_DAC: FPGA1.N24(IO_L15N_T2_DQS_DOUT_CSO_B_14)
SEN_TX_ADC: FPGA1.N21(IO_L13P_T2_MRCC_14)
SEN_TX_DAC: FPGA1.R21(IO_L18N_T2_A11_D27_14)
TCK: CPLD1.11(TCK) FPGA1.H12(TCK_0) XC5.6(TCK)
TDI_CPLD: CPLD1.9(TDI) R121.2 R122.2
TDI_FPGA: FPGA1.H10(TDI_0) R119.2 R123.1
TDI_PORT: R119.1 R121.1 XC5.10(TDI)
TDO_CPLD: CPLD1.24(TDO) R120.2 R123.2
TDO_FPGA: FPGA1.J10(TDO_0) R118.2 R122.1
TDO_PORT: R118.1 R120.1 XC5.8(TDO)
TMS: CPLD1.10(TMS) FPGA1.H11(TMS_0) XC5.4(TMS)
TXD: FPGA1.R25(IO_L19P_T3_A10_D26_14) R136.1
WDI: FPGA1.R20(IO_L18P_T2_A12_D28_14) IC16.6(WDI) R143.1
NetC260_2: C260.2 IC16.2(SWT)
NetC262_2: C262.2 IC16.3(SRT)
NetCPLD1_7: CPLD1.7(I/O) LED8.1(K)
NetCPLD1_8: CPLD1.8(I/O) LED7.1(K)
NetIC16_1: IC16.1(RSTin) R128.1 R129.2
NetLED7_2: LED7.2(A) R113.1
NetLED8_2: LED8.2(A) R114.1
NetLED9_1: LED9.1(K) Q13.3(D)
NetLED9_2: LED9.2(A) R137.1
NetLED10_3: LED10.3(K) R148.2
NetLED10_4: LED10.4(K) R149.1
NetLED11_3: LED11.3(K) R146.2
NetLED11_4: LED11.4(K) R147.2
NetLED12_3: LED12.3(K) R145.1
NetLED12_4: LED12.4(K) R144.1
NetQ7_3: Q7.3(D) R144.2
NetQ8_3: Q8.3(D) R145.2
NetQ9_3: Q9.3(D) R149.2
NetQ10_3: Q10.3(D) R148.1
NetQ11_3: Q11.3(D) R146.1
NetQ12_3: Q12.3(D) R147.1
NetR135_2: R135.2 XC7.2
NetR136_2: R136.2 XC7.3

Not connected (* = marked no-connect by the designer): CPLD1 27(I/O) 28(I/O); FPGA1 K25(IO_L7P_T1_D09_14) K26(IO_L7N_T1_D10_14) M21(IO_L12P_T1_MRCC_14) M22(IO_L12N_T1_MRCC_14) M25(IO_L10N_T1_D15_14)* M26(IO_L20N_T3_A07_D23_14) N26(IO_L20P_T3_A08_D24_14) P23(IO_L17P_T2_A14_D30_14) P24(IO_L17N_T2_A13_D29_14) R22(IO_L23N_T3_A02_D18_14) R23(IO_L24N_T3_A00_D16_14) T22(IO_L23P_T3_A03_D19_14)* T23(IO_L24P_T3_A01_D17_14) T24(IO_L21P_T3_DQS_14) T25(IO_L21N_T3_DQS_A06_D22_14); XC5 12(NC) 14(SRST); XC6 8(DAT1) 9(DAT2)

### Layout directives
net class Power: DVDD_FPGA, GND

### Notes on the sheet
- Подп. и дата
- Инв. № дубл.
- Взам. инв. №
- Инв. № подл.
- Лист
- Изм.
- № докум.
- Подп.
- Дата
- Копировал
- Формат А3
- (in symbol XC7A200T-2FBG676C, part C) BANK 14
- (in symbol XC9572XL-10VQ44C, part A) BANK 1
- (in symbol XC9572XL-10VQ44C, part B) BANK 2
- (in symbol XC9572XL-10VQ44C, part C) BANK 3
- (in symbol XC9572XL-10VQ44C, part D) BANK 4

### Library data of the parts
C260 = Cer Cap: Cer Cap Small; Manufacturer: Murata; Material: x7r; Voltage: 50V; Tolerance: 10%; Type: Ceramic; PackageReference: SMD Chip Capacitor; Package: 0603
C261 C262 = Cer Cap: Cer Cap Small; Manufacturer: Murata; Material: x7r; Voltage: 16V; Tolerance: 10%; Type: Ceramic; PackageReference: SMD Chip Capacitor; Package: 0603
CPLD1 = XC9572XL-10VQ44C: FastFLASH XC900XL, 3.3V High-Performance 72 Macrocell CPLD, 34 User I/Os, 44-Pin VQFP, Speed Grade 10, Commercial Grade; Supply Current: 20 mA; Max Operational Frequency: 100 MHz; Gates: 1600; Macrocells: 72; User I/O: 34; Name: XC9572XL-10VQ44C; Voltage: 3.3 V; Package: VQFP44; Type: CPLD
FLASH1 = SST25VF016B-xx-xx-S2Ax: SPI Flash; Manufacturer: Micron Technology; Name: N25Q128A13ESE40F; Operating Frequency: 50 MHz; Device Density: 128 Mbit; Voltage: 2.7-3.6V; Type: SPI Flash; Package: SOIC; Temperature Range: 0°C to +70°C
FPGA1 = XC7A200T-2FBG676C: Artix-7 FPGA, 400 User I/Os, 8 GTP, 676-Ball BGA, Speed Grade 2, Commercial Grade, Pb-Free; Manufacturer: Xilinx; Block RAM Blocks (18Kb): 730; Block RAM Blocks (36Kb): 365; Block RAM Blocks (Max Kb): 13140; CLBs (Slices): 33650; Clock Mgmt Tiles (CMTs): 10; DSP48E1 Slices: 740; Logic Cells: 215360; Max User I/O: 500; Speed Grade: -2; DatasheetVersion: v1.12; PackageVersion: Rev 1.8; PackageReference: FBG676; PackageDescription: Flip-Chip Lidless BGA, Body 27 x 27 mm, 1.0 mm Pitch; Supplier 1: Digi-Key; Supplier Part Number 1: 122-1865-ND; CLBs (Max Distributed RAM Kb): 2888; Generic Part Number: XC7A200T; RoHS: Pb-Free; NexusDeviceID: XC7A200T-2FBG676C; Mounting Technology: Surface Mount; Code_JEDEC: MS-034; PartNumber: XC7A200T-2FBG676C; ComponentLink1Description: Manufacturer URL; ComponentLink1URL: http://www.xilinx.com/; ComponentLink2Description: Datasheet; ComponentLink2URL: http://www.xilinx.com/support/documentation/data_sheets/ds180_7Series_Overview.pdf; ComponentLink3Description: Package Specification; ComponentLink3URL: http://www.xilinx.com/support/documentation/user_guides/ug475_7Series_Pkg_Pinout.pdf; ComponentLink4Description: DC and Switching Characteristics; ComponentLink4URL: http://www.xilinx.com/support/documentation/data_sheets/ds181_Artix_7_Data_Sheet.pdf; ComponentLink5Description: Package File; ComponentLink5URL: http://www.xilinx.com/support/packagefiles/a7packages/xc7a200tfbg676pkg.txt; ComponentLink6Description: Packaging and Pinout; ComponentLink6URL: http://www.xilinx.com/support/documentation/user_guides/ug475_7Series_Pkg_Pinout.pdf
IC15 = 24lc024: I2C EEPROM; Manufacturer: Microchip; Voltage: 2.5-5.5V; Max Clock: 400 kHz; Capacity: 2 Kbit; Name: 24lc024; Type: I2C EEPROM; Package: SOIC-8
IC16 = MAX6749KA+T: uC Reset Circuits; Manufacturer: Maxim; Voltage: 1.0-5.5V; RESET IN Threshold: 1.235V; Name: MAX6749KA+T; Package: 8 SOT23
LED7-LED9 = LED: Typical RED, GREEN, YELLOW, AMBER GaAs LED; Manufacturer: Kingbright; Color: Blue; P/N: APHHS1005QBC/D; Package: 0402; Name: LED
LED10-LED12 = LED_PACK: LED Pack For Front Panel; Manufacturer: Kingbright; Type: 2-level PCB-mount LED-indicator; Current: 25mA; P/N: WP934EB/2GD; Color: Green; Package: Throu-Hole
Q7-Q13 = 2N7002: N-Channel MOSFET 2N7002; Current: 300mA; Voltage: 60V; Channel Resistance: 5Ohm; Power Dissipation: 0.83W; Name: 2N7002; Type: N-Channel MOSFET; Package: SOT-23
R113 R114 R118-R130 R133 R135-R137 R140-R149 R222-R227 = Res: Resistor; Name: Chip SMD Resistor; Tolerance: 5%; Power: 0.062 Wt; Temperature Range: -55…155
  R113 R114 R118-R129 R133 R135 R136 R140-R149: Package: SMD
  R130 R137 R222-R227: Package: 0402
R115-R117 R232-R236 = Res_Switch: Resistor; Name: Chip SMD Resistor; Tolerance: 5%; Power: 0.062 Wt; Package: SMD; Temperature Range: -55…155
S1 = Push Button: Manufacturer: Omron; Operating  force: 2.55 N; Plunger  color: Black; Voltage: 24V; Current: 50mA; Name: B3FS-1000; Type: Tactile Switch (SMT); Package: 6x6 SMT; Series: B3FS-1000
XC5 = JTAG Male: Male Header JTAG; Manufacturer: CNC Tech; Name: BOX HEADER, 0.050 14 POS; P/N: 3220-14-0100-00; Type: Two Row Male Header .050'' Step
XC6 = SD_Card: Manufacturer: Tyco Electronics; Name: 1775059-1; Type: SD Card Connector, Reverse Type; Package: SMD PCB Mount
XC7 = 4-Way Header: 4-Way Angle PCB Header; Pitch: 2.54mm; Name: Header; Type: Right Angle; Package: Through Hole

## Sheet Clocking.SchDoc: {Наименование}
size 420 x 297 mm; DocumentNumber: ПЛАС.ХХХХХХ.ХХХ ХХ; SheetNumber: 6; SheetTotal: 11; PageSetup: Record=PageOptions|CenterHorizontal=False|CenterVertical=False|PrintScale=0.95|XCorrection=0.00|YCorrection=0.00|PrintKind=1|BorderSize=5000000|LeftOffset=0|BottomOffset=0|Orientation=1|PaperLength=1000|PaperWidth=1000|Scale=100|PaperSource=15|PrintQuality=600|MediaType=1|DitherType=10|PaperKind=A4|PrintScaleMode=1; Rule: PcbType=ProtelPcb
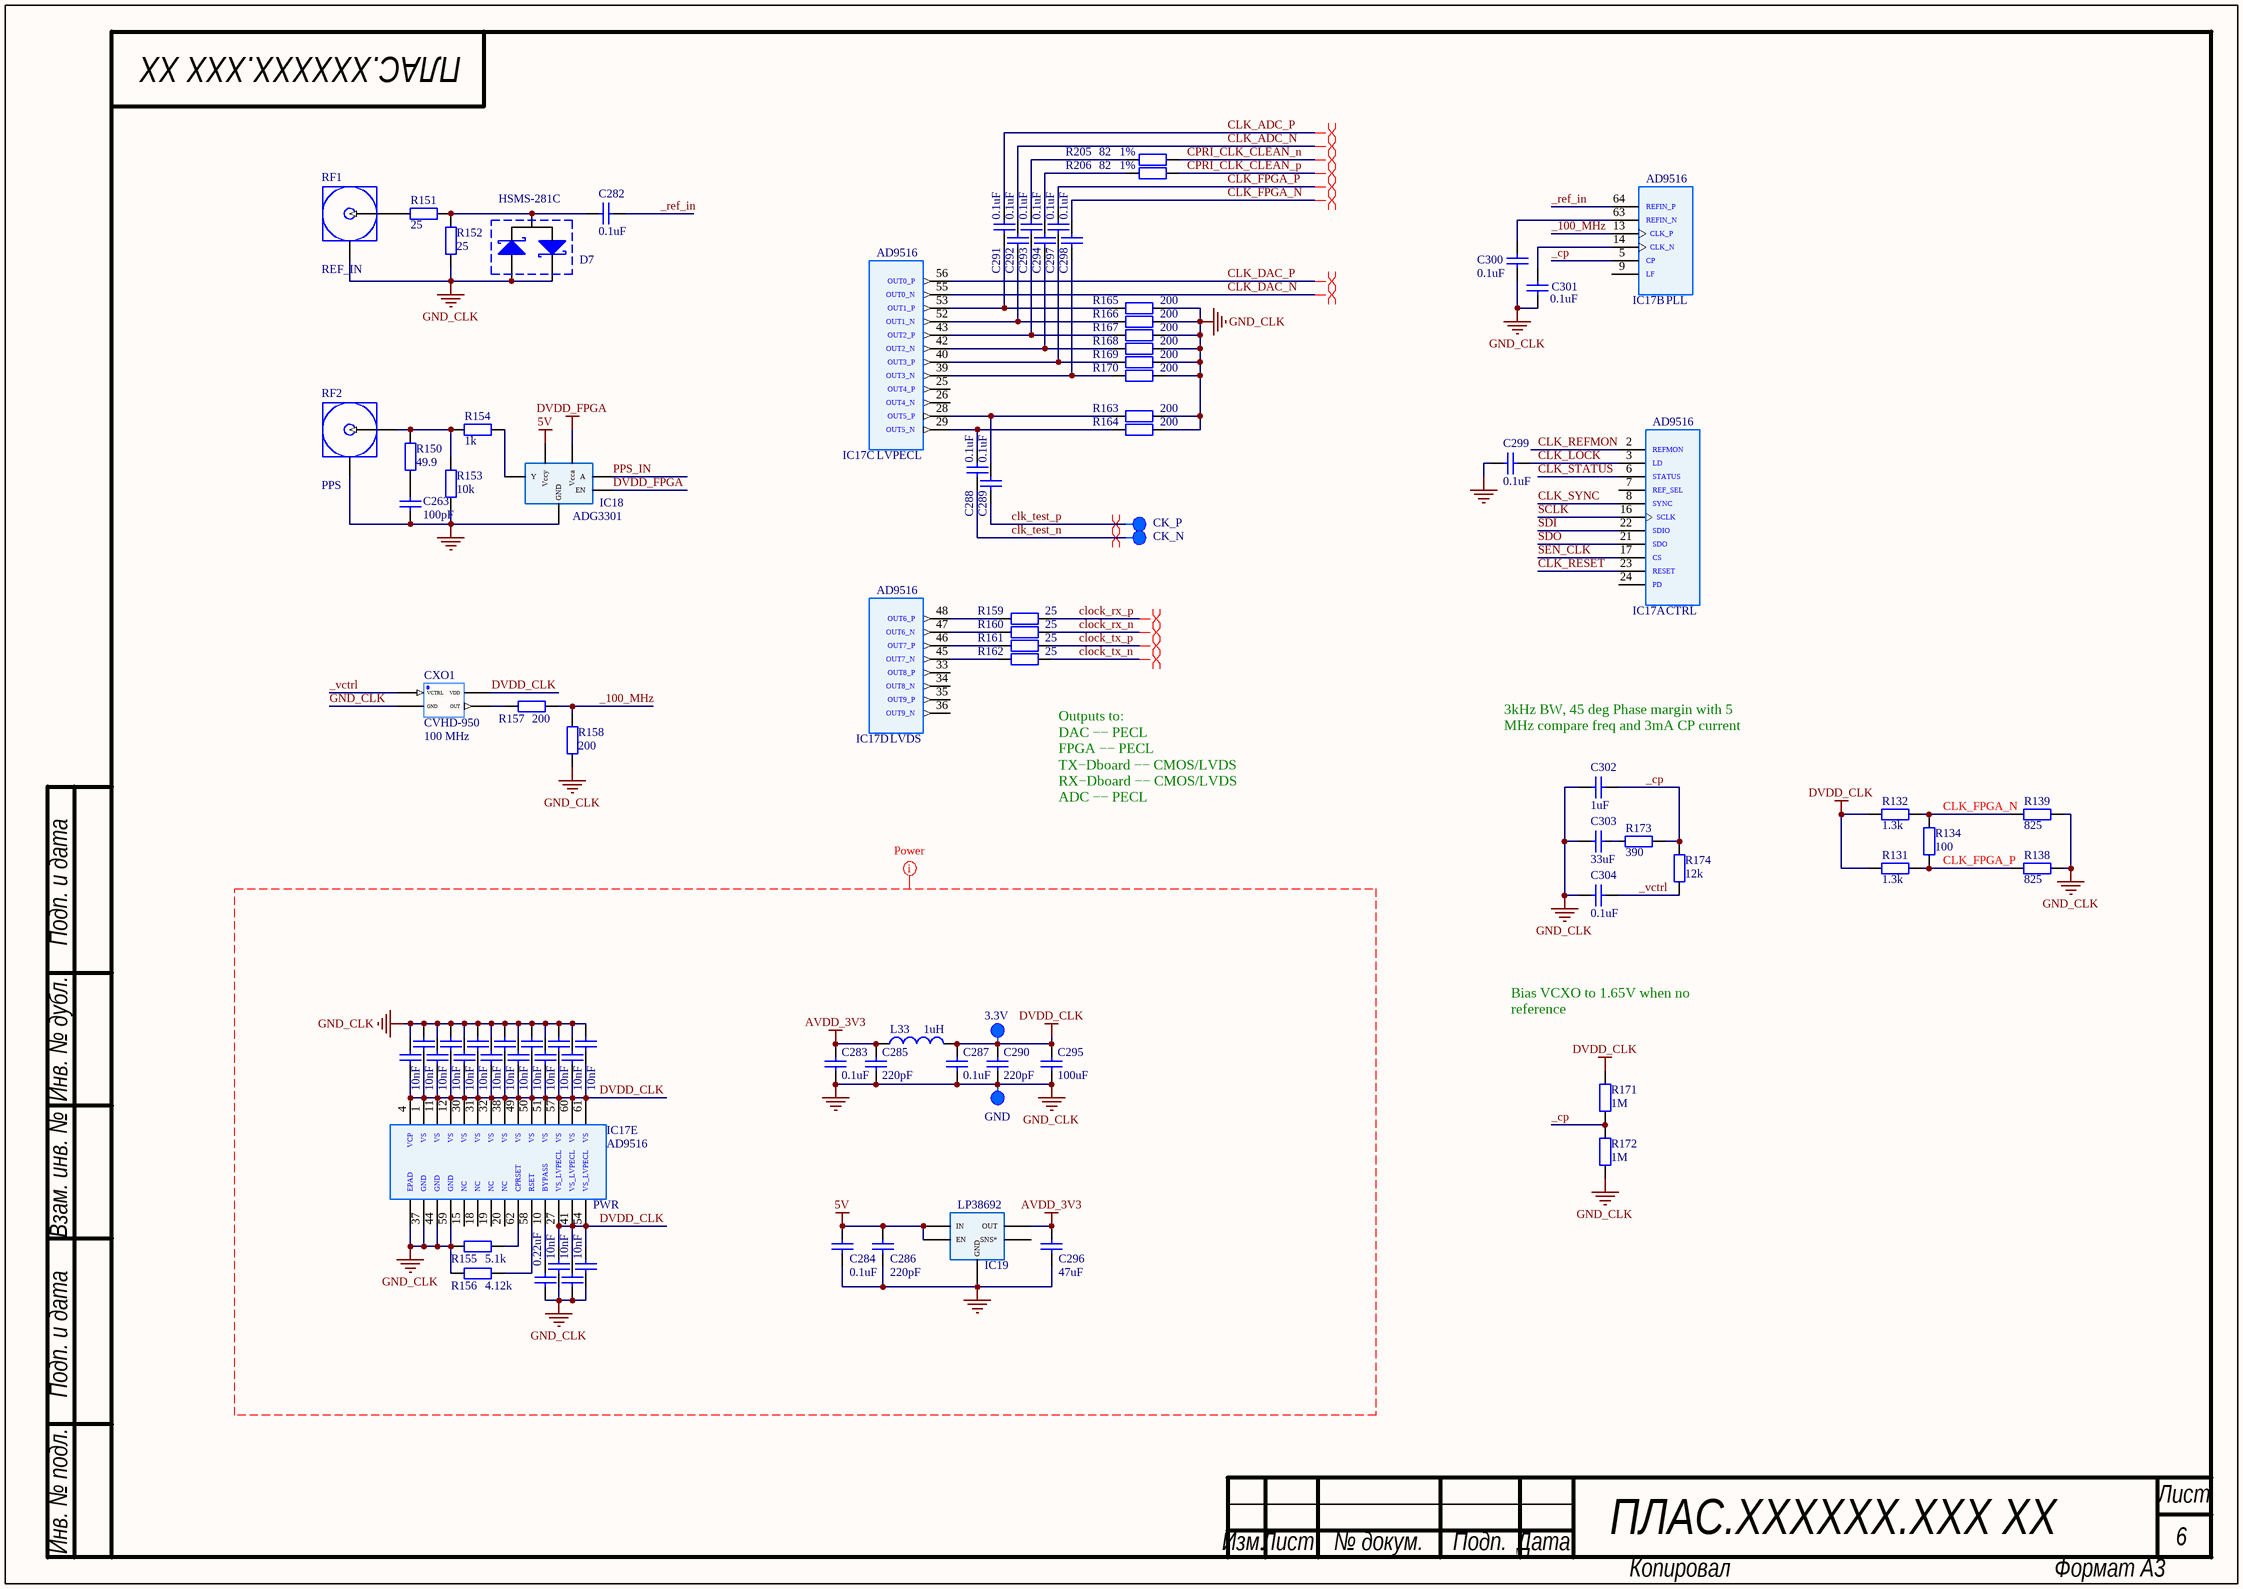
[diagram p5: Clocking.SchDoc]

### Parts
C263  value 100pF  [С0402]  (hidden comment: Cap)
C264  value 10nF  [С0402]  (hidden comment: Cap)
C265  value 10nF  [С0402]  (hidden comment: Cap)
C266  value 10nF  [С0402]  (hidden comment: Cap)
C267  value 10nF  [С0402]  (hidden comment: Cap)
C268  value 10nF  [С0402]  (hidden comment: Cap)
C269  value 10nF  [С0402]  (hidden comment: Cap)
C270  value 10nF  [С0402]  (hidden comment: Cap)
C271  value 10nF  [С0402]  (hidden comment: Cap)
C272  value 10nF  [С0402]  (hidden comment: Cap)
C273  value 10nF  [С0402]  (hidden comment: Cap)
C274  value 10nF  [С0402]  (hidden comment: Cap)
C275  value 0.22uF  [С0402]  (hidden comment: Cap)
C276  value 10nF  [С0402]  (hidden comment: Cap)
C277  value 10nF  [С0402]  (hidden comment: Cap)
C278  value 10nF  [С0402]  (hidden comment: Cap)
C279  value 10nF  [С0402]  (hidden comment: Cap)
C280  value 10nF  [С0402]  (hidden comment: Cap)
C281  value 10nF  [С0402]  (hidden comment: Cap)
C282  value 0.1uF  [С0402]  (hidden comment: Cap)
C283  value 0.1uF  [C0603]  (hidden comment: Cap)
C284  value 0.1uF  [C0603]  (hidden comment: Cap)
C285  value 220pF  [C0603]  (hidden comment: Cap)
C286  value 220pF  [C0603]  (hidden comment: Cap)
C287  value 0.1uF  [C0603]  (hidden comment: Cap)
C288  value 0.1uF  [С0402]  (hidden comment: Cap)
C289  value 0.1uF  [С0402]  (hidden comment: Cap)
C290  value 220pF  [C0603]  (hidden comment: Cap)
C291  value 0.1uF  [С0402]  (hidden comment: Cap)
C292  value 0.1uF  [С0402]  (hidden comment: Cap)
C293  value 0.1uF  [С0402]  (hidden comment: Cap)
C294  value 0.1uF  [С0402]  (hidden comment: Cap)
C295  value 100uF  [C1210]  (hidden comment: Cap)
C296  value 47uF  [C1210]  (hidden comment: Cap)
C297  value 0.1uF  [С0402]  (hidden comment: Cap)
C298  value 0.1uF  [С0402]  (hidden comment: Cap)
C299  value 0.1uF  [С0402]  (hidden comment: Cap)
C300  value 0.1uF  [С0402]  (hidden comment: Cap)
C301  value 0.1uF  [С0402]  (hidden comment: Cap)
C302  value 1uF  [C0603]  (hidden comment: Cap)
C303  value 33uF  [C1210]  (hidden comment: Cap)
C304  value 0.1uF  [C0603]  (hidden comment: Cap)
CP9  3.3V  [Control Point]
CP10  GND  [Control Point]
CP11  CK_P  [Control Point]
CP12  CK_N  [Control Point]
CXO1  CVHD-950  Frequency: 100 MHz  [CVHD-950]
D7  HSMS-281C  [SOT-323]
IC17  AD9516  [LFCSP-64]  (parts A,B,C,D,E of 5)
IC18  ADG3301  [SOT-23-6]
IC19  LP38692  [SOT-223-5]
L33  value 1uH  [L1210_Murata]  (hidden comment: Inductor_LF)
R131  value 1.3k  [R0402]  (hidden comment: Res)
R132  value 1.3k  [R0402]  (hidden comment: Res)
R134  value 100  [R0402]  (hidden comment: Res)
R138  value 825  [R0402]  (hidden comment: Res)
R139  value 825  [R0402]  (hidden comment: Res)
R150  value 49.9  [R0402]  (hidden comment: Res)
R151  value 25  [R0402]  (hidden comment: Res)
R152  value 25  [R0402]  (hidden comment: Res)
R153  value 10k  [R0402]  (hidden comment: Res)
R154  value 1k  [R0402]  (hidden comment: Res)
R155  value 5.1k  [R0402]  (hidden comment: Res)
R156  value 4.12k  [R0402]  (hidden comment: Res)
R157  value 200  [R0402]  (hidden comment: Res)
R158  value 200  [R0402]  (hidden comment: Res)
R159  value 25  [R0402]  (hidden comment: Res)
R160  value 25  [R0402]  (hidden comment: Res)
R161  value 25  [R0402]  (hidden comment: Res)
R162  value 25  [R0402]  (hidden comment: Res)
R163  value 200  [R0402]  (hidden comment: Res)
R164  value 200  [R0402]  (hidden comment: Res)
R165  value 200  [R0402]  (hidden comment: Res)
R166  value 200  [R0402]  (hidden comment: Res)
R167  value 200  [R0402]  (hidden comment: Res)
R168  value 200  [R0402]  (hidden comment: Res)
R169  value 200  [R0402]  (hidden comment: Res)
R170  value 200  [R0402]  (hidden comment: Res)
R171  value 1M  [R0402]  (hidden comment: Res)
R172  value 1M  [R0402]  (hidden comment: Res)
R173  value 390  [R0402]  (hidden comment: Res)
R174  value 12k  [R0402]  (hidden comment: Res)
R205  value 82  Tolerance: 1%  [R0402]  (hidden comment: Res)
R206  value 82  Tolerance: 1%  [R0402]  (hidden comment: Res)
RF1  REF_IN  [SMA Angle Female With Term]
RF2  PPS  [SMA Angle Female With Term]

### Nets
5V: C284.1 C286.1 IC18.6(Vccy) IC19.1(EN) IC19.4(IN)
AVDD_3V3: C283.1 C285.1 C296.1 IC19.3(OUT) L33.2
DVDD_CLK: C264.1 C265.2 C266.1 C267.2 C268.1 C269.2 C270.1 C271.2 C272.1 C273.2 C274.1 C276.2 C277.2 C278.1 C279.2 C280.2 C281.2 C287.1 C290.1 C295.2 CP9.1 CXO1.4(VDD) IC17.1(VS) IC17.4(VCP) IC17.11(VS) IC17.12(VS) IC17.27(VS_LVPECL) IC17.30(VS) IC17.31(VS) IC17.32(VS) IC17.38(VS) IC17.41(VS_LVPECL) IC17.49(VS) IC17.50(VS) IC17.51(VS) IC17.54(VS_LVPECL) IC17.57(VS) IC17.60(VS) IC17.61(VS) L33.1 R131.1 R132.1 R171.1
DVDD_FPGA: IC18.1(Vcca) IC18.4(EN)
GND: C263.1 C264.2 C265.1 C266.2 C267.1 C268.2 C269.1 C270.2 C271.1 C272.2 C273.1 C274.2 C275.1 C276.1 C277.1 C278.2 C279.1 C280.1 C281.1 C283.2 C284.2 C285.2 C286.2 C287.2 C290.2 C295.1 C296.2 C299.1 C300.2 C301.2 C302.1 C303.2 C304.1 CP10.1 CXO1.2(GND) D7.1(A) D7.2(K) IC17.0(EPAD) IC17.37(GND) IC17.44(GND) IC17.59(GND) IC18.3(GND) IC19.5(GND) R138.2 R139.1 R152.2 R153.1 R155.1 R156.1 R158.2 R163.1 R164.1 R165.1 R166.1 R167.1 R168.1 R169.1 R170.1 R172.2 RF1.0(GND) RF2.0(GND)  [also labelled GND_CLK]
_100_MHz: IC17.13(CLK_P) R157.1 R158.1
_cp: C302.2 IC17.5(CP) R171.2 R172.1 R173.1 R174.2
_ref_in: C282.1 IC17.64(REFIN_P)
_vctrl: C304.2 CXO1.1(VCTRL) R174.1
CLK_ADC_N: C292.1
CLK_ADC_P: C291.1
CLK_DAC_N: IC17.55(OUT0_N)
CLK_DAC_P: IC17.56(OUT0_P)
CLK_FPGA_N: C298.1 R132.2 R134.2 R139.2
CLK_FPGA_P: C297.1 R131.2 R134.1 R138.1
CLK_LOCK: C299.2 IC17.3(LD)
CLK_REFMON: IC17.2(REFMON)
CLK_RESET: IC17.23(RESET)
CLK_STATUS: IC17.6(STATUS)
CLK_SYNC: IC17.8(SYNC)
clk_test_n: C288.2 CP12.1
clk_test_p: C289.2 CP11.1
clock_rx_n: R160.1
clock_rx_p: R159.1
clock_tx_n: R162.1
clock_tx_p: R161.1
CPRI_CLK_CLEAN_n: R205.2
CPRI_CLK_CLEAN_p: R206.2
PPS_IN: IC18.2(A)
SCLK: IC17.16(SCLK)
SDI: IC17.22(SDIO)
SDO: IC17.21(SDO)
SEN_CLK: IC17.17(CS)
NetC263_2: C263.2 R150.1
NetC275_2: C275.2 IC17.10(BYPASS)
NetC282_2: C282.2 D7.3(K) R151.1 R152.1
NetC288_1: C288.1 IC17.29(OUT5_N) R164.2
NetC289_1: C289.1 IC17.28(OUT5_P) R163.2
NetC291_2: C291.2 IC17.53(OUT1_P) R165.2
NetC292_2: C292.2 IC17.52(OUT1_N) R166.2
NetC293_1: C293.1 R205.1
NetC293_2: C293.2 IC17.43(OUT2_P) R167.2
NetC294_1: C294.1 R206.1
NetC294_2: C294.2 IC17.42(OUT2_N) R168.2
NetC297_2: C297.2 IC17.40(OUT3_P) R169.2
NetC298_2: C298.2 IC17.39(OUT3_N) R170.2
NetC300_1: C300.1 IC17.63(REFIN_N)
NetC301_1: C301.1 IC17.14(CLK_N)
NetC303_1: C303.1 R173.2
NetCXO1_3: CXO1.3(OUT) R157.2
NetIC17_45: IC17.45(OUT7_N) R162.2
NetIC17_46: IC17.46(OUT7_P) R161.2
NetIC17_47: IC17.47(OUT6_N) R160.2
NetIC17_48: IC17.48(OUT6_P) R159.2
NetIC17_58: IC17.58(RSET) R156.2
NetIC17_62: IC17.62(CPRSET) R155.2
NetIC18_5: IC18.5(Y) R154.1
NetR150_2: R150.2 R153.2 R154.2 RF2.1(RF)
NetR151_2: R151.2 RF1.1(RF)

Not connected (* = marked no-connect by the designer): IC17 7(REF_SEL) 9(LF) 15(NC) 18(NC) 19(NC) 20(NC) 24(PD) 25(OUT4_P) 26(OUT4_N) 33(OUT8_P) 34(OUT8_N) 35(OUT9_P) 36(OUT9_N); IC19 6(SNS*)

### Layout directives
net class Power: 5V, AVDD_3V3, DVDD_CLK, GND, GND_CLK
differential pair: CLK_ADC_N, CLK_ADC_P, CLK_DAC_N, CLK_DAC_P, CLK_FPGA_N, CLK_FPGA_P, clk_test_n, clk_test_p, clock_rx_n, clock_rx_p, clock_tx_n, clock_tx_p, CPRI_CLK_CLEAN_n, CPRI_CLK_CLEAN_p

### Notes on the sheet
- (near C302) 3kHz BW, 45 deg Phase margin with 5 MHz compare freq and 3mA CP current
- Outputs to:
  DAC −− PECL
  FPGA −− PECL
  TX−Dboard −− CMOS/LVDS
  RX−Dboard −− CMOS/LVDS
  ADC −− PECL
- Bias VCXO to 1.65V when no reference
- Подп. и дата
- Инв. № дубл.
- Взам. инв. №
- Инв. № подл.
- Лист
- Изм.
- № докум.
- Подп.
- Дата
- Копировал
- Формат А3
- (in symbol AD9516, part A) CTRL
- (in symbol AD9516, part B) PLL
- (in symbol AD9516, part C) LVPECL
- (in symbol AD9516, part D) LVDS
- (in symbol AD9516, part E) PWR

### Library data of the parts
C263 C283-C287 C290 = Cer Cap: Cer Cap Small; Manufacturer: Murata; Material: x5r; Voltage: 16V; Tolerance: 10%; Type: Ceramic; PackageReference: SMD Chip Capacitor
  C263: Package: 0402
  C283-C287 C290: Package: 0603
C264-C274 C276-C281 = Cer Cap: Cer Cap Small; Manufacturer: Murata; Material: x7r; Voltage: 25V; Tolerance: 10%; Type: Ceramic; PackageReference: SMD Chip Capacitor; Package: 0402
C275 C282 C288 C289 C291-C294 C297-C301 C304 = Cer Cap: as C261 on sheet JTAG; PackageReference: SMD Chip Capacitor; Package: 0402
C295 C296 C303 = Cap uF: Cer Cap Large; Manufacturer: Murata; Material: x5r; Tolerance: 20%; Voltage: 6.3V; Type: Ceramic; Package: C1210; PackageDescription: SMD Chip Capacitor
C302 = Cer Cap: Cer Cap Small; Manufacturer: Murata; Material: x7r; Voltage: 10V; Tolerance: 10%; Type: Ceramic; PackageReference: SMD Chip Capacitor; Package: 0402
CP9-CP12 = Control Point: Name: Control Point
CXO1 = CVHD-950: Crystal Oscillator; Name: CVHD-950-100.000; Voltage: 3.3V ±0.3V; Output: Symmetry; Output Current: ±24mA Max; Input Current: 15mA Typical; Package: CVHD-950; Temperature Range: 0°C to +70°C
D7 = HSMS-281x: RF Schottky Barrier Diodes; Name: HSMS-281C; Package: SOT-323
IC17 = AD9516: 14-Output Clock Generator; Name: AD9516-4; Voltage: 2.5 V to 3.3 V; Input Frequency: 0 to 2.4 GHz; Output Frequency, Maximum: 2950 MHz; Input Sensitivity: 150 mV p-p; Type: 14-Output Clock Generator; Package: LFSCSP-64; Temperature Range: −40°C to +85°C
IC18 = ADG3301: Bidirectional Logic Level Translator; Voltage: 1.15 V to 5.5 V; Name: ADG3301; Package: SOT-23-6
IC19 = LP38692: Linear Regulator; Name: LP28692MP-3.3; Input Voltage: 2.7 V to 10 V; Output Accuracy: 2.5%; Dropout Voltage: 450 mV at 1 A; Package: SOT-223-5; Type: Linear Regulator; Temperature Range: –40°C to 125°C
L33 = Inductor_LF: Inductor_Power_Lines; Manufacturer: Murata; Name: LQM32PN1R0MG0; Tolerance: 5%; Current: 1800mA; Frequency: 40MHz; Package: 1210; PackageDescription: Chip Inductor; Temperature Range: -25…85; Series: LQM
R131 R132 R134 R138 R139 R150-R174 = Res: as R113 on sheet JTAG; Temperature Range: -55…155
  R131 R132 R134 R138 R139 R151 R152 R155-R174: Package: SMD
  R150 R153 R154: Package: 0402
R205 R206 = Res: Resistor; Name: Chip SMD Resistor; Power: 0.062 Wt; Package: SMD; Temperature Range: -55…155
RF1 RF2 = SMA Angle Female: SMA Male Right-Angle PCM Connector; Name: SMA Right Angle PCB Mount RF Connector; Type: SMA